# EAGLE schematic Pure Noise (EAGLE 8.3.1)
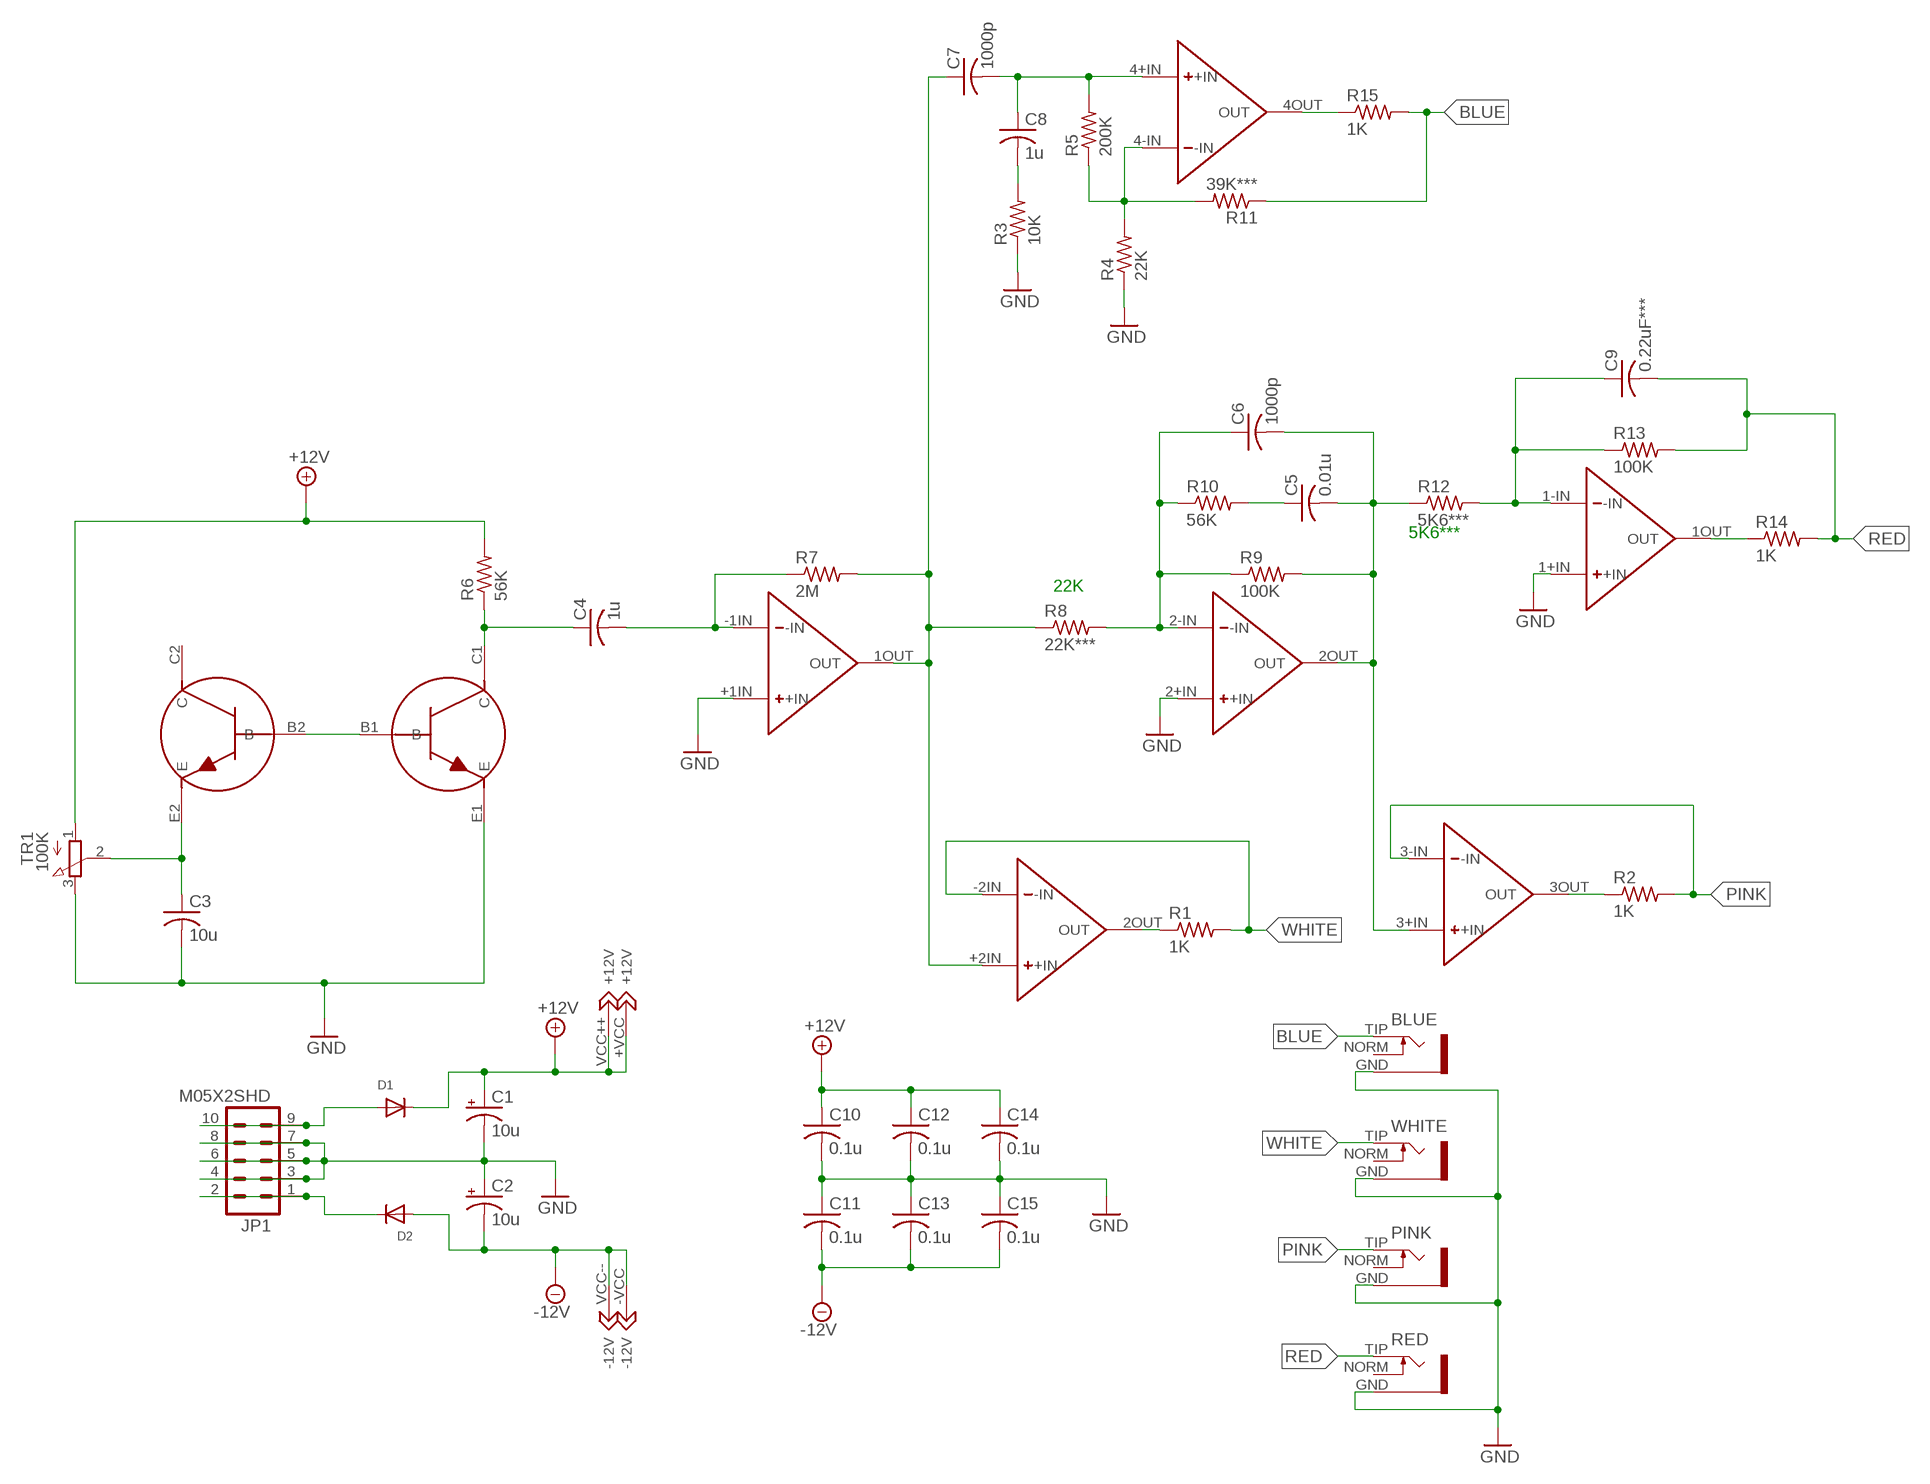
[diagram p0: schematic, sheet 1]

## Parts
BLUE  S_JACK  [S_JACK]
C1  10u  CPOL-US153CLV-0505  [153CLV-0505]
C2  10u  CPOL-US153CLV-0505  [153CLV-0505]
C3  10u  C-USC1206K  [C1206K]
C4  1u  C-USC0805K  [C0805K]
C5  0.01u  C-USC0805K  [C0805K]
C6  1000p  C-USC0805K  [C0805K]
C7  1000p  C-USC0805K  [C0805K]
C8  1u  C-USC0805K  [C0805K]
C9  0.22uF***  C-USC0805K  [C0805K]
C10  0.1u  C-USC0805K  [C0805K]
C11  0.1u  C-USC0805K  [C0805K]
C12  0.1u  C-USC0805K  [C0805K]
C13  0.1u  C-USC0805K  [C0805K]
C14  0.1u  C-USC0805K  [C0805K]
C15  0.1u  C-USC0805K  [C0805K]
D1  DIODESMA  [SMADIODE]
D2  DIODESMA  [SMADIODE]
JP1  M05X2SHD  [2X5-SHROUDED]
PINK  S_JACK  [S_JACK]
R1  1K  R-US_R0805  [R0805]
R2  1K  R-US_R0805  [R0805]
R3  10K  R-US_R0805  [R0805]
R4  22K  R-US_R0805  [R0805]
R5  200K  R-US_R0805  [R0805]
R6  56K  R-US_R0805  [R0805]
R7  2M  R-US_R0805  [R0805]
R8  22K***  R-US_R0805  [R0805]
R9  100K  R-US_R0805  [R0805]
R10  56K  R-US_R0805  [R0805]
R11  39K***  R-US_R0805  [R0805]
R12  5K6***  R-US_R0805  [R0805]
R13  100K  R-US_R0805  [R0805]
R14  1K  R-US_R0805  [R0805]
R15  1K  R-US_R0805  [R0805]
RED  S_JACK  [S_JACK]
TR1  100K  TRIMMER_TH3  [TRIMMER_TH3]
U$1  DUAL_OPAMP  [DUAL_OPAMP]
U$6  QUAD_OPAMP  [QUAD_OPAMP]
U$9  TRANS_PAIR  [TRANS_PAIR]
WHITE  S_JACK  [S_JACK]

## Nets
+12V: C1.+ C10.1 C12.1 C14.1 D1.C R6.2 TR1.1 U$1.+VCC(+12V) U$6.VCC++(+12V)
-12V: C2.- C11.2 C13.2 C15.2 D2.A U$1.-VCC(-12V) U$6.VCC--(-12V)
BLUE: BLUE.TIP R11.1 R15.2
GND: BLUE.GND C1.- C2.+ C3.2 C10.2 C11.1 C12.2 C13.1 C14.2 C15.1 JP1.3 JP1.4 JP1.5 JP1.6 JP1.7 JP1.8 PINK.GND R3.1 R4.1 RED.GND TR1.3 U$1.+1IN(+IN) U$6.1+IN(+IN) U$6.2+IN(+IN) U$9.E1(E) WHITE.GND
N$1: R1.1 U$1.2OUT(OUT)
N$2: R2.1 U$6.3OUT(OUT)
N$3: C8.2 R3.2
N$4: C7.2 C8.1 R5.2 U$6.4+IN(+IN)
N$5: R4.2 R5.1 R11.2 U$6.4-IN(-IN)
N$6: C9.1 R12.2 R13.1 U$6.1-IN(-IN)
N$8: R14.1 U$6.1OUT(OUT)
N$9: D1.A JP1.9 JP1.10
N$10: D2.C JP1.1 JP1.2
N$11: R15.1 U$6.4OUT(OUT)
N$12: U$9.B1(B) U$9.B2(B)
N$13: C3.1 TR1.2 U$9.E2(E)
N$14: C4.1 R6.1 U$9.C1(C)
N$15: C4.2 R7.1 U$1.-1IN(-IN)
N$16: C6.1 R8.2 R9.1 R10.1 U$6.2-IN(-IN)
N$17: C5.1 R10.2
N$19: C7.1 R7.2 R8.1 U$1.1OUT(OUT) U$1.+2IN(+IN)
N$23: C5.2 C6.2 R9.2 R12.1 U$6.2OUT(OUT) U$6.3+IN(+IN)
PINK: PINK.TIP R2.2 U$6.3-IN(-IN)
RED: C9.2 R13.2 R14.2 RED.TIP
WHITE: R1.2 U$1.-2IN(-IN) WHITE.TIP
Unconnected: BLUE.NORM PINK.NORM RED.NORM U$9.C2(C) WHITE.NORM

## Notes on the sheet
- 5K6***
- 22K

## Library data of the parts
BLUE PINK RED WHITE = INSTRUO:S_JACK
C1 C2 = rcl:CPOL-US: POLARIZED CAPACITOR, American symbol
C3-C15 = rcl:C-US: CAPACITOR, American symbol
D1 D2 = adafruit:DIODE: Diode SMADIODE - SMA Surface Mount Package 20V 1A Schottky Diode Digikey: 641-1014-6-ND DO-1N4148 - Through Hole Small Current Diode SOD-123 20V 1 A (.5mV Vf) Schottky Diode - Digikey: MBRX120TPMSCT-ND SOD-323 10V 570mA (.38mV Vf, 3ns) Schottky Diode - Digikey: ZLLS410CT-ND SOD-523 30V 30mA Schottky Diode (RB751S-40TE61) - Digikey: RB751S-40TE61CT-ND SOT23-R/W - SOT23 Package (R = Solder Paste/Reflow Ovens, W = Hand-Soldering) BAT54Film 40V 300mA - Digikey: 497-7162-1-ND
JP1 = SparkFun-Connectors:M05X2: Header 5x2 Standard 10-pin dual row 0.1" header. Commonly used with AVR-ISP. Use with Spark Fun Electronics SKU: PRT-00778
R1-R15 = rcl:R-US_: RESISTOR, American symbol
TR1 = GMSN:TRIMMER_TH3
U$1 = INSTRUO:DUAL_OPAMP
U$6 = QuBit:QUAD_OPAMP
U$9 = QuBit:TRANS_PAIR